# EAGLE design CS_SNS (EAGLE 9.5.0)
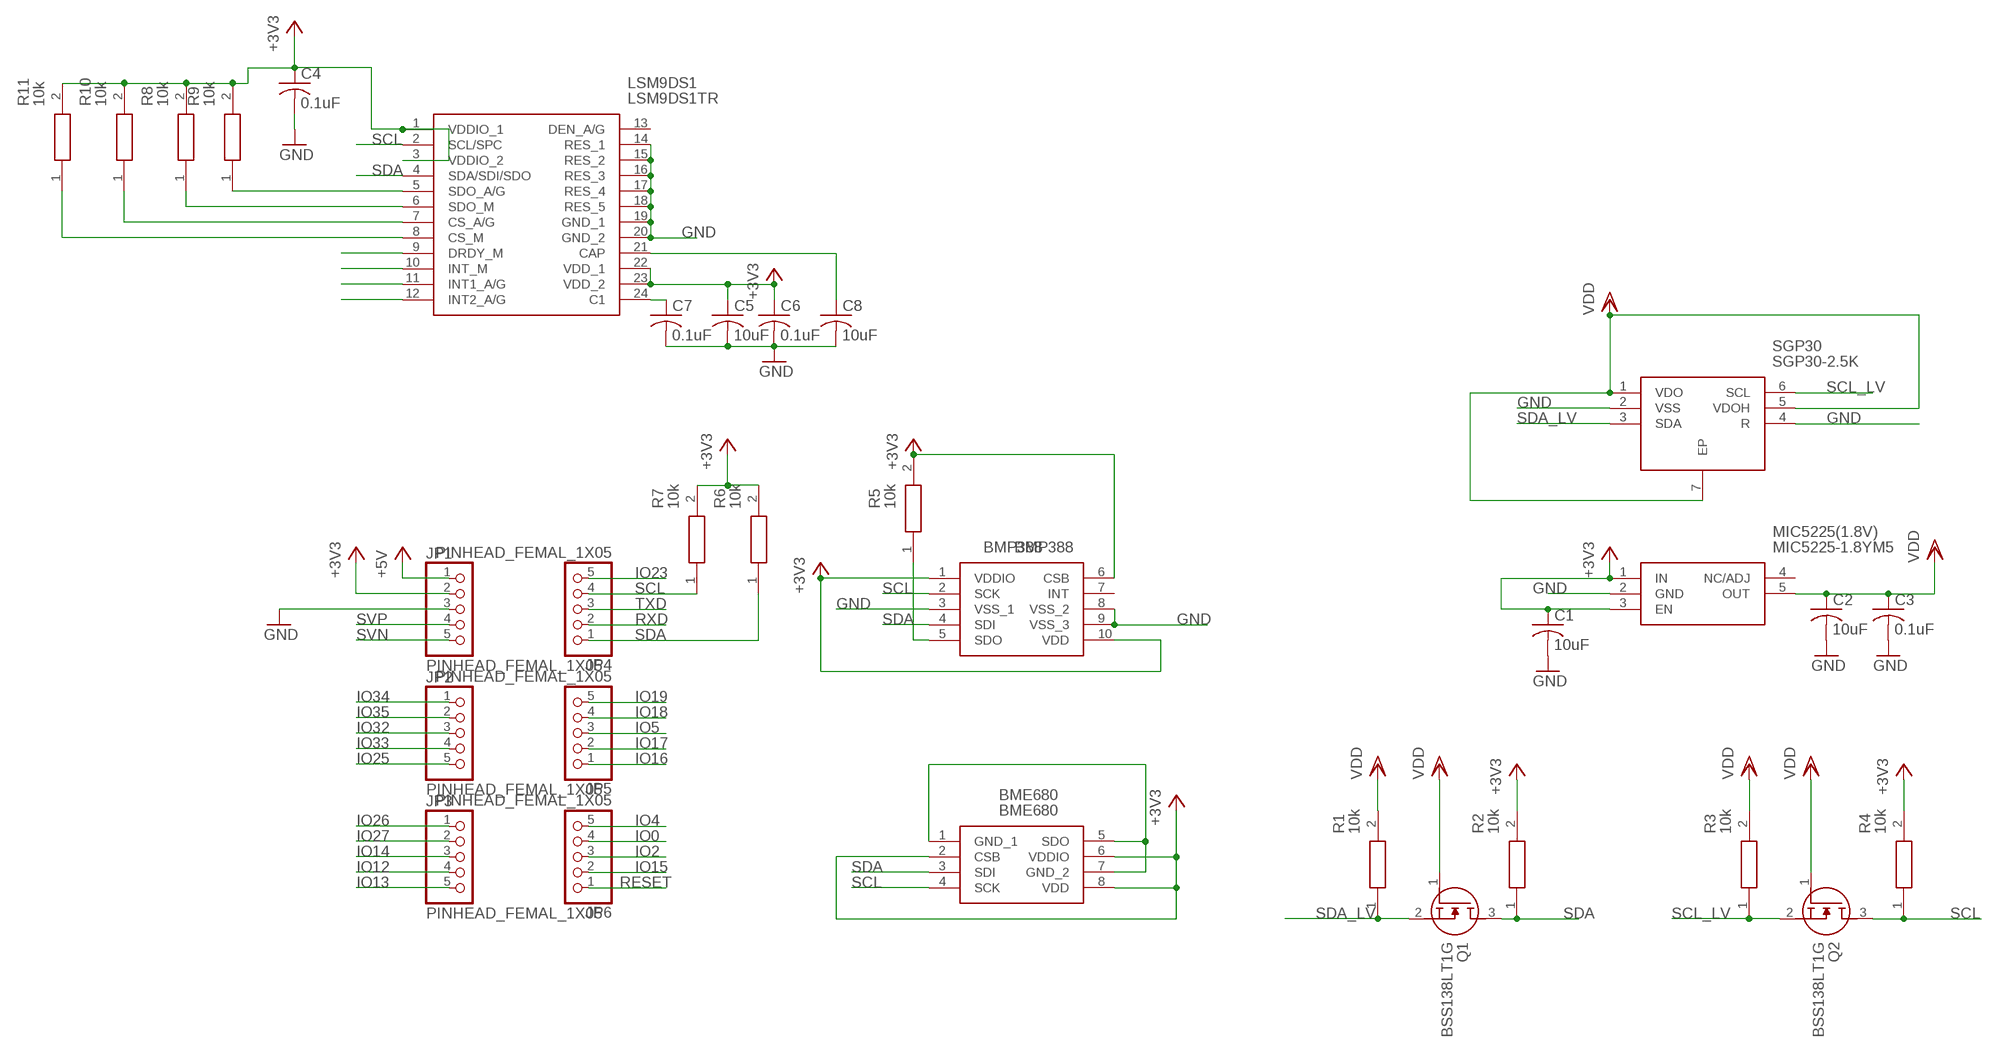
[diagram p0: schematic, sheet 1]

## Parts
BME680  BME680  [BME680]
BMP388  BMP388  [BMP388]
C1  10uF  C-USC0805  [C0805]
C2  10uF  C-USC0805  [C0805]
C3  0.1uF  C-USC0805  [C0805]
C4  0.1uF  C-USC0805  [C0805]
C5  10uF  C-USC0805  [C0805]
C6  0.1uF  C-USC0805  [C0805]
C7  0.1uF  C-USC0805  [C0805]
C8  10uF  C-USC0805  [C0805]
JP1  PINHEAD_FEMAL_1X05  [1X05F]
JP2  PINHEAD_FEMAL_1X05  [1X05F]
JP3  PINHEAD_FEMAL_1X05  [1X05F]
JP4  PINHEAD_FEMAL_1X05  [1X05F]
JP5  PINHEAD_FEMAL_1X05  [1X05F]
JP6  PINHEAD_FEMAL_1X05  [1X05F]
LSM9DS1  LSM9DS1TR  [LGA-24L(3X3.5X1MM)]
MIC5225(1.8V)  MIC5225-1.8YM5  [SOT95P280X145-5N]
Q1  BSS138LT1G  [SOT96P237X111-3N]
Q2  BSS138LT1G  [SOT96P237X111-3N]
R1  10k  ERA-6AED134V  [RESC2012X60N]
R2  10k  ERA-6AED134V  [RESC2012X60N]
R3  10k  ERA-6AED134V  [RESC2012X60N]
R4  10k  ERA-6AED134V  [RESC2012X60N]
R5  10k  ERA-6AED134V  [RESC2012X60N]
R6  10k  ERA-6AED134V  [RESC2012X60N]
R7  10k  ERA-6AED134V  [RESC2012X60N]
R8  10k  ERA-6AED134V  [RESC2012X60N]
R9  10k  ERA-6AED134V  [RESC2012X60N]
R10  10k  ERA-6AED134V  [RESC2012X60N]
R11  10k  ERA-6AED134V  [RESC2012X60N]
SGP30  SGP30-2.5K  [SON80P245X245X90-7N]

## Nets
+3V3: BME680.2(CSB) BME680.6(VDDIO) BME680.8(VDD) BMP388.1(VDDIO) BMP388.6(CSB) BMP388.10(VDD) C1.1 C4.1 C5.1 C6.1 JP1.2 LSM9DS1.1(VDDIO_1) LSM9DS1.3(VDDIO_2) LSM9DS1.22(VDD_1) LSM9DS1.23(VDD_2) MIC5225(1.8V).1(IN) MIC5225(1.8V).3(EN) R2.2 R4.2 R5.2 R6.2 R7.2 R8.2 R9.2 R10.2 R11.2
+5V: JP1.1
GND: BMP388.3(VSS_1) BMP388.8(VSS_2) BMP388.9(VSS_3) C1.2 C2.2 C3.2 C4.2 C5.2 C6.2 C7.2 C8.2 JP1.3 LSM9DS1.14(RES_1) LSM9DS1.15(RES_2) LSM9DS1.16(RES_3) LSM9DS1.17(RES_4) LSM9DS1.18(RES_5) LSM9DS1.19(GND_1) LSM9DS1.20(GND_2) MIC5225(1.8V).2(GND) SGP30.2(VSS) SGP30.4(R)
IO0: JP6.4
IO2: JP6.3
IO4: JP6.5
IO5: JP5.3
IO12: JP3.4
IO13: JP3.5
IO14: JP3.3
IO15: JP6.2
IO16: JP5.1
IO17: JP5.2
IO18: JP5.4
IO19: JP5.5
IO23: JP4.5
IO25: JP2.5
IO26: JP3.1
IO27: JP3.2
IO32: JP2.3
IO33: JP2.4
IO34: JP2.1
IO35: JP2.2
N$1: LSM9DS1.9(DRDY_M)
N$2: BMP388.5(SDO) R5.1
N$3: BME680.1(GND_1) BME680.5(SDO) BME680.7(GND_2)
N$4: LSM9DS1.5(SDO_A/G) R9.1
N$5: LSM9DS1.6(SDO_M) R8.1
N$6: C7.1 LSM9DS1.24(C1)
N$7: C8.1 LSM9DS1.21(CAP)
N$8: LSM9DS1.7(CS_A/G) R10.1
N$9: LSM9DS1.8(CS_M) R11.1
N$10: LSM9DS1.10(INT_M)
N$11: LSM9DS1.11(INT1_A/G)
N$12: LSM9DS1.12(INT2_A/G)
RESET: JP6.1
RXD: JP4.2
SCL: BME680.4(SCK) BMP388.2(SCK) JP4.4 LSM9DS1.2(SCL/SPC) Q2.3(D) R4.1 R7.1
SCL_LV: Q2.2(S) R3.1 SGP30.6(SCL)
SDA: BME680.3(SDI) BMP388.4(SDI) JP4.1 LSM9DS1.4(SDA/SDI/SDO) Q1.3(D) R2.1 R6.1
SDA_LV: Q1.2(S) R1.1 SGP30.3(SDA)
SVN: JP1.5
SVP: JP1.4
TXD: JP4.3
VDD: C2.1 C3.1 MIC5225(1.8V).5(OUT) Q1.1(G) Q2.1(G) R1.2 R3.2 SGP30.1(VDO) SGP30.5(VDOH) SGP30.7(EP)
Unconnected: BMP388.7(INT) LSM9DS1.13(DEN_A/G) MIC5225(1.8V).4(NC/ADJ)

## Library data of the parts
BME680 = SamacSys_3D:BME680: Air Quality Sensors Environmental Sensor VOC IIR EMC Source: Datasheet <https://ae-bst.resource.bosch.com/media/_tech/media/datasheets/BST-BME680-DS001.pdf>; DESCRIPTION: Air Quality Sensors Environmental Sensor VOC IIR EMC; HEIGHT: 1mm; MANUFACTURER_NAME: Bosch; MANUFACTURER_PART_NUMBER: BME680; MOUSER_PART_NUMBER: 262-BME680
BMP388 = SamacSys_3D:BMP388: Board Mount Pressure Sensors MEMS Absolute Barometric Pressure Sensor Source: Datasheet <https://ae-bst.resource.bosch.com/media/_tech/media/datasheets/BST-BMP388-DS001-01.pdf>; DESCRIPTION: Board Mount Pressure Sensors MEMS Absolute Barometric Pressure Sensor; HEIGHT: 0mm; MANUFACTURER_NAME: Bosch Sensortec; MANUFACTURER_PART_NUMBER: BMP388; MOUSER_PART_NUMBER: 262-BMP388; MOUSER_PRICE-STOCK: https://www.mouser.com/Search/Refine.aspx?Keyword=262-BMP388
C1-C8 = rcl:C-US: CAPACITOR, American symbol; SPICEPREFIX: C
JP1-JP6 = SamacSys_3D:PINHEAD_FEMAL_1X05
LSM9DS1 = SamacSys_3D:LSM9DS1TR: iNEMO Inertial 3D Accel/Gyro/Magn. LGA24 STMicroelectronics LSM9DS1TR 3-Axis Accelerometer, Gyroscope & Magnetometer, 0 400 kHz, 1.9 3.6 V Source: Datasheet <http://www.st.com/content/ccc/resource/technical/document/datasheet/1e/3f/2a/d6/25/eb/48/46/DM00103319.pdf/files/DM00103319.pdf/jcr:content/translations/en.DM00103319.pdf>; DESCRIPTION: iNEMO Inertial 3D Accel/Gyro/Magn. LGA24 STMicroelectronics LSM9DS1TR 3-Axis Accelerometer, Gyroscope & Magnetometer, 0 400 kHz, 1.9 3.6 V; HEIGHT: mm; MANUFACTURER_NAME: STMicroelectronics; MANUFACTURER_PART_NUMBER: LSM9DS1TR; MOUSER_PART_NUMBER: 511-LSM9DS1TR; MOUSER_PRICE-STOCK: https://www.mouser.com/Search/Refine.aspx?Keyword=511-LSM9DS1TR; RS_PART_NUMBER: 1660908; RS_PRICE-STOCK: https://uk.rs-online.com/web/p/products/1660908
MIC5225(1.8V) = SamacSys_3D:MIC5225-1.8YM5: Ultra-Low Quiescent Current 150mA uCap Low Dropout Regulator Source: Datasheet <http://www.mouser.com/ds/2/268/mic5225-1082288.pdf>; DESCRIPTION: Ultra-Low Quiescent Current 150mA uCap Low Dropout Regulator; HEIGHT: 1.45mm; MANUFACTURER_NAME: Micrel; MANUFACTURER_PART_NUMBER: MIC5225-1.8YM5
Q1 Q2 = SamacSys_3D:BSS138LT1G: MOSFET N-Channel 50V 0.2A SOT23 ON Semiconductor BSS138LT1G N-channel MOSFET Transistor, 0.2 A, 50 V, 3-Pin SOT-23 Source: Datasheet <http://www.onsemi.com/pub/Collateral/BSS138LT1-D.PDF>; ALLIED_NUMBER: 70099493; ALLIED_PRICE-STOCK: http://www.alliedelec.com/on-semiconductor-bss138lt1g/70099493/; DESCRIPTION: MOSFET N-Channel 50V 0.2A SOT23 ON Semiconductor BSS138LT1G N-channel MOSFET Transistor, 0.2 A, 50 V, 3-Pin SOT-23; HEIGHT: 1.11mm; MANUFACTURER_NAME: ON Semiconductor; MANUFACTURER_PART_NUMBER: BSS138LT1G; MOUSER_PART_NUMBER: 863-BSS138LT1G; MOUSER_PRICE-STOCK: https://www.mouser.com/Search/Refine.aspx?Keyword=863-BSS138LT1G; RS_PART_NUMBER: 5452529P; RS_PRICE-STOCK: http://uk.rs-online.com/web/p/products/5452529P
R1-R11 = SamacSys_3D:ERA-6AED134V: PANASONIC ELECTRONIC COMPONENTS - ERA-6AED134V - RES, THIN FILM, 130K, 0.5%, 0.125W, 0805 Source: Datasheet <https://industrial.panasonic.com/cdbs/www-data/pdf/RDA0000/AOA0000C237.pdf>; DESCRIPTION: PANASONIC ELECTRONIC COMPONENTS - ERA-6AED134V - RES, THIN FILM, 130K, 0.5%, 0.125W, 0805; HEIGHT: 0.6mm; MANUFACTURER_NAME: Panasonic; MANUFACTURER_PART_NUMBER: ERA-6AED134V; MOUSER_PART_NUMBER: 667-ERA-6AED134V; MOUSER_PRICE-STOCK: https://www.mouser.com/Search/Refine.aspx?Keyword=667-ERA-6AED134V
SGP30 = SamacSys_3D:SGP30-2.5K: Air Quality Sensors Multi-Pixel SGP Gas Sensor Source: Datasheet <http://www.mouser.com/ds/2/682/Sensirion_Gas_Sensors_SGP30_Preliminary_Datasheet-1128067.pdf>; DESCRIPTION: Air Quality Sensors Multi-Pixel SGP Gas Sensor; HEIGHT: 0.9mm; MANUFACTURER_NAME: Sensirion; MANUFACTURER_PART_NUMBER: SGP30-2.5k; MOUSER_PART_NUMBER: 403-SGP30-2.5K; MOUSER_PRICE-STOCK: https://www.mouser.com/Search/Refine.aspx?Keyword=403-SGP30-2.5K; RS_PART_NUMBER: 1463573; RS_PRICE-STOCK: http://uk.rs-online.com/web/p/products/1463573

## Board
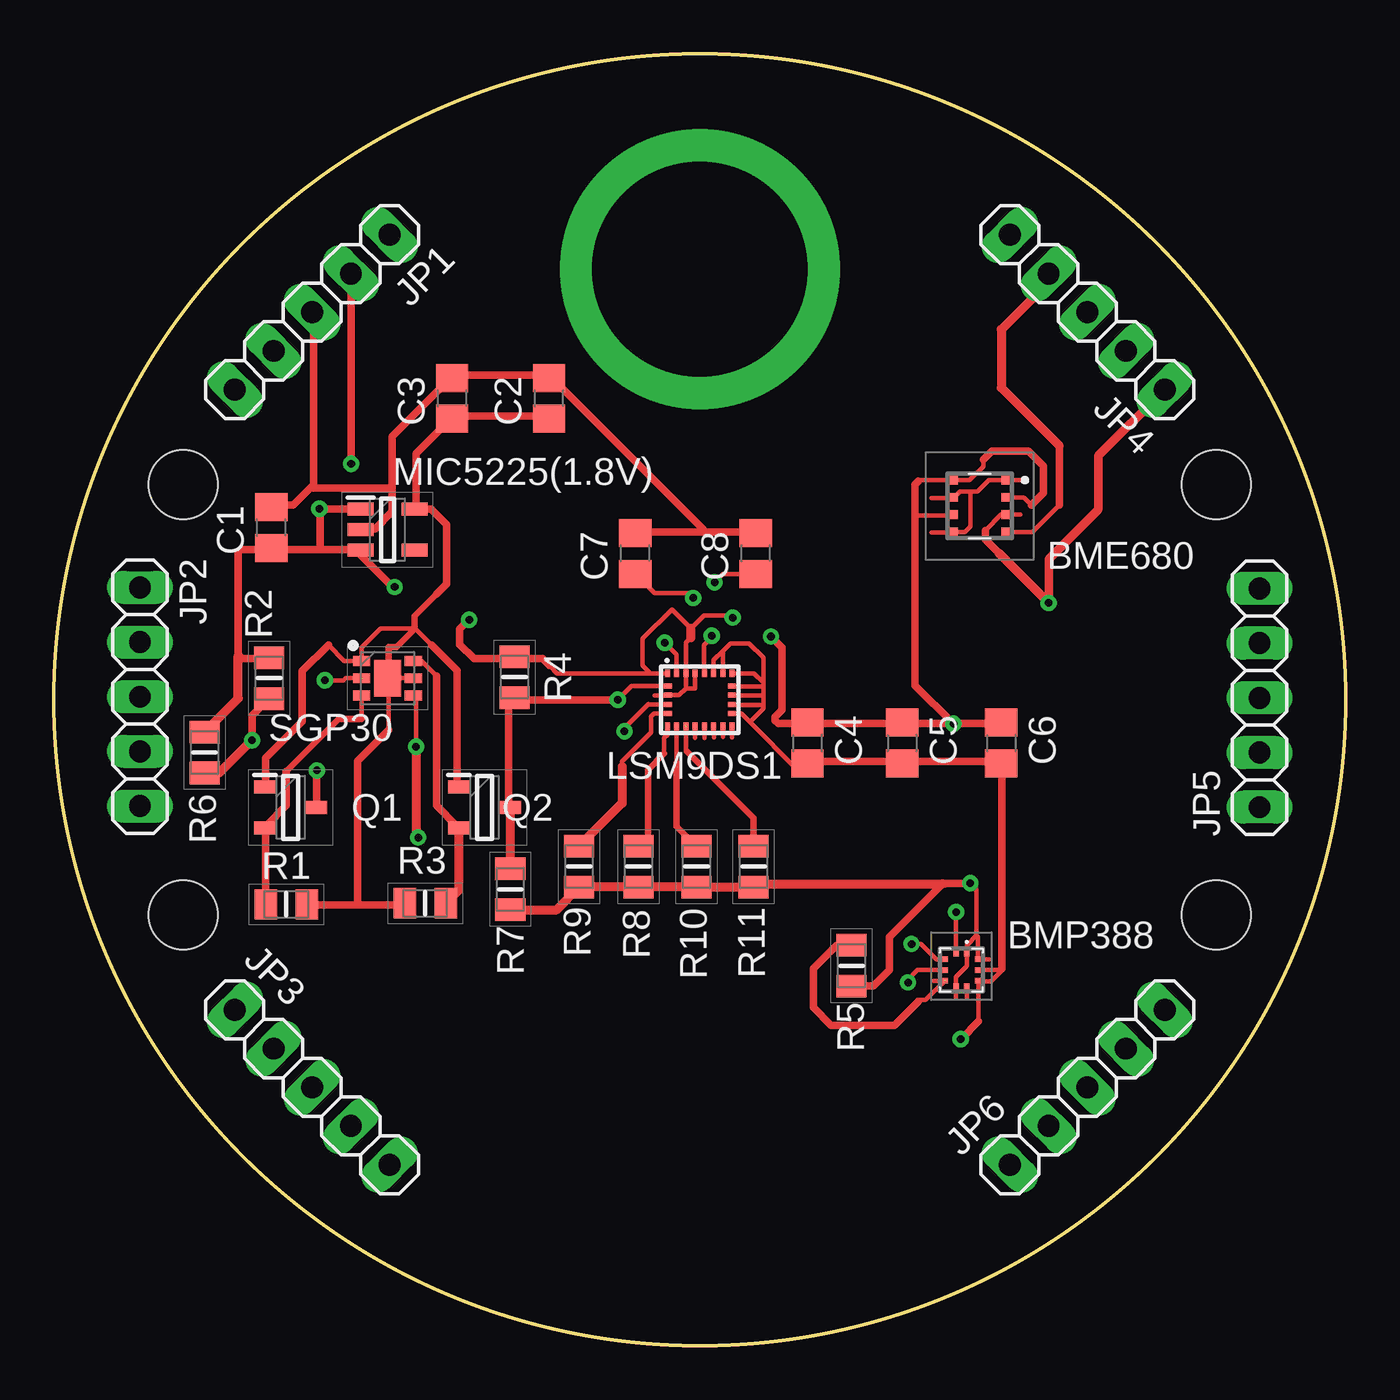
[diagram p1: board, top side]
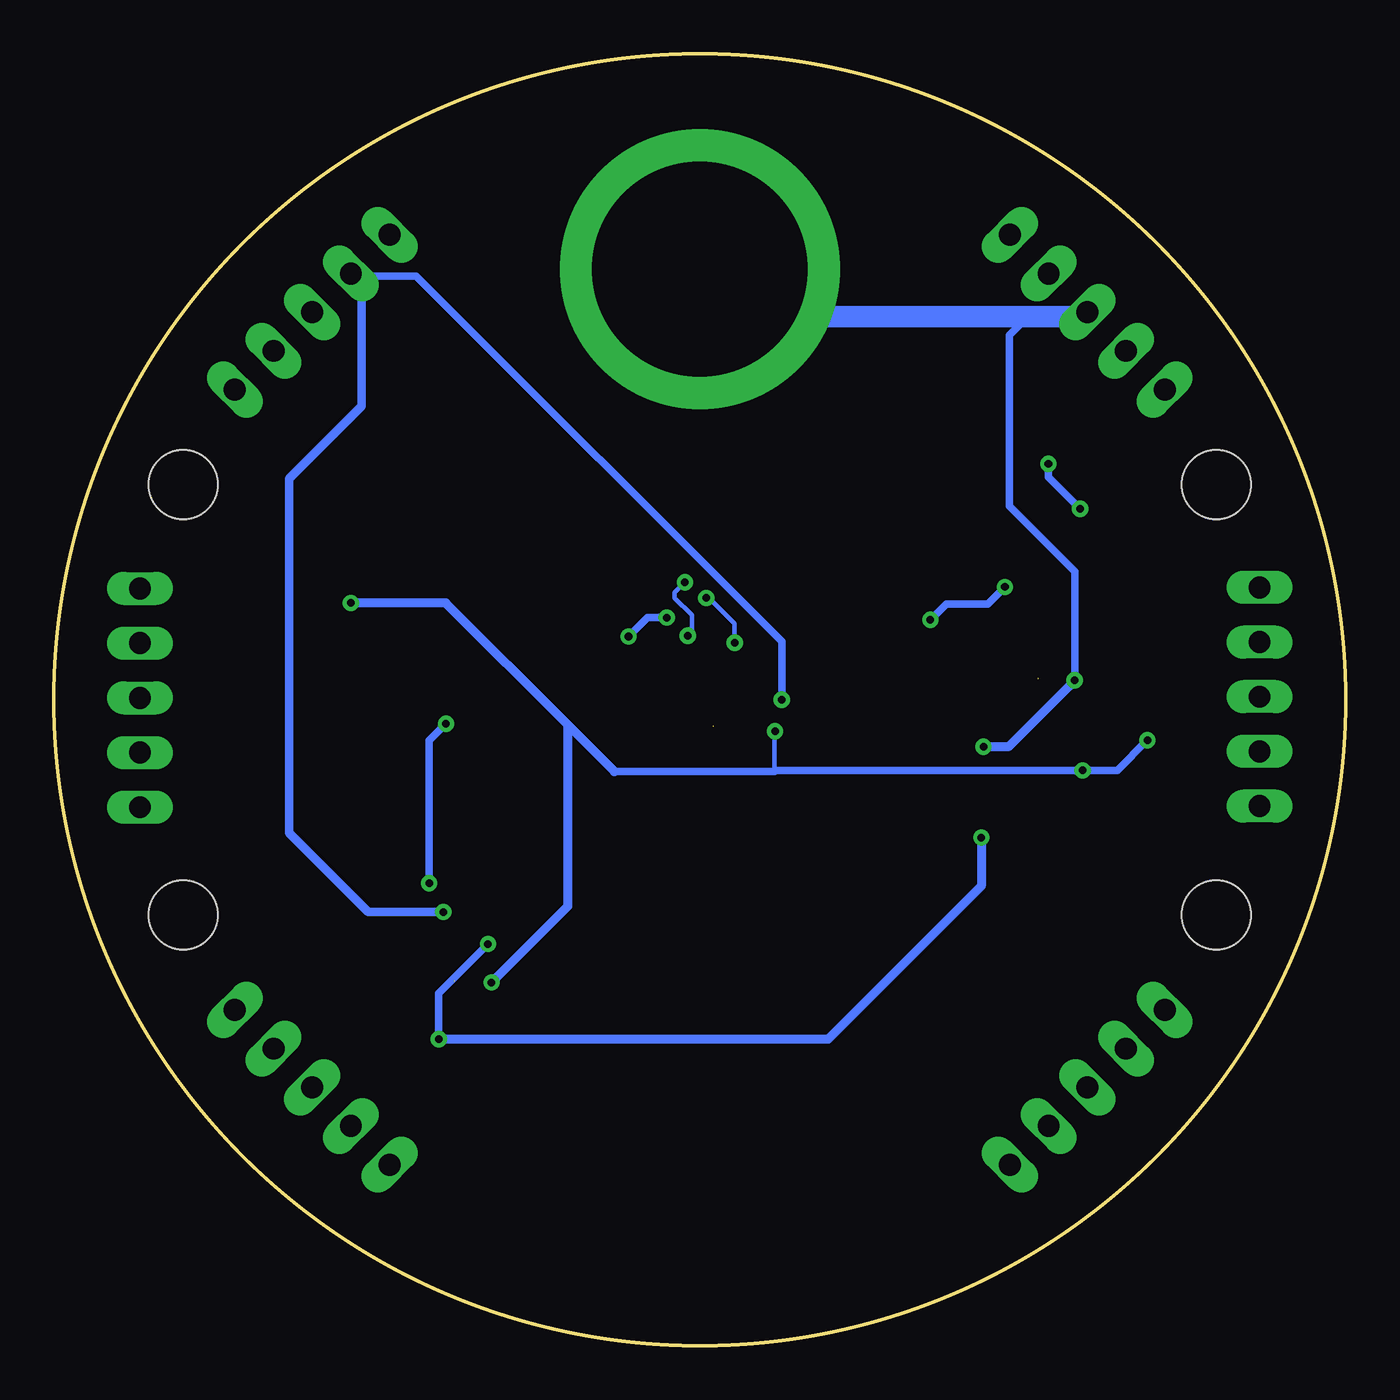
[diagram p2: board, bottom side, seen from below]

Size 60 x 60 mm. Coordinates in mm from the lower left corner, seen from the top.
Outline: circle at 30,30 radius 30
Copper layers (1*16): Top 0.035mm / dielectric 1.5mm / Bottom 0.035mm
Design rules "CanSat *": minimum track width 0.2mm, minimum drill 0.35mm, track to track 8mil, track to pad 8mil, pad to pad 7mil, via to via 15mil, smd to smd 6mil, copper to edge 1.5mm, drill to drill 10mil, minimum pad ring 10mil, minimum via ring 8mil, stop-mask expansion 6mil, vias tented up to drill 0mil, thermal gap 8mil
Holes 3.2 mm at 6,40 6,20 54,40 54,20

### Footprints (pad centres in the part's own frame; a part is rotated, then mirrored left to right if it is on the bottom)
BME680 = smd 0.4 x 0.4: 1 1.2,1.2; 2 1.2,0.4; 3 1.2,-0.4; 4 1.2,-1.2; 5 -1.2,-1.2; 6 -1.2,-0.4; 7 -1.2,0.4; 8 -1.2,1.2
BMP388 = smd 0.25 x 0.275: 1 0.25,0.763; 2 -0.25,0.763; 6 -0.25,-0.763; 7 0.25,-0.763 | smd 0.275 x 0.25: 3 -0.762,0.5; 4 -0.762,0; 5 -0.762,-0.5; 8 0.762,-0.5; 9 0.762,0; 10 0.762,0.5
C0805 = smd 1.3 x 1.5: 1 -0.95,0; 2 0.95,0
1X05F = drill 1.016 long: 1 -5.08,0; 2 -2.54,0; 3 0,0; 4 2.54,0; 5 5.08,0
LGA-24L(3X3.5X1MM) = smd 0.23 x 0.35: 1 -1.505,1.225; 6 -1.505,-1.225; 7 -1.075,-1.225; 8 -0.645,-1.225; 9 -0.215,-1.225; 10 0.215,-1.225; 11 0.645,-1.225; 12 1.075,-1.225; 13 1.505,-1.225; 18 1.505,1.225; 19 1.075,1.225; 20 0.645,1.225; 21 0.215,1.225; 22 -0.215,1.225; 23 -0.645,1.225; 24 -1.075,1.225 | smd 0.35 x 0.23: 2 -1.475,0.645; 3 -1.475,0.215; 4 -1.475,-0.215; 5 -1.475,-0.645; 14 1.475,-0.645; 15 1.475,-0.215; 16 1.475,0.215; 17 1.475,0.645
SOT95P280X145-5N = smd 1.2 x 0.6: 1 -1.25,0.95; 2 -1.25,0; 3 -1.25,-0.95; 4 1.25,-0.95; 5 1.25,0.95
SOT96P237X111-3N = smd 1 x 0.6: 1 -1.2,0.955; 2 -1.2,-0.955; 3 1.2,0
RESC2012X60N = smd 1.05 x 1.4: 1 -0.95,0; 2 0.95,0
SON80P245X245X90-7N = smd 0.8 x 0.45: 1 -1.2,0.8; 2 -1.2,0; 3 -1.2,-0.8; 4 1.2,-0.8; 5 1.2,0; 6 1.2,0.8 | smd 1.25 x 1.7: 7 0,0

### Placement (x,y rotation side)
BME680  43,39 0 top
BMP388  42.15,17.45 0 top
C1  10.1,38 90 top
C2  23,44 90 top
C3  18.5,44 90 top
C4  35,28 270 top
C5  39.4,28 270 top
C6  44,28 270 top
C7  27,36.8 90 top
C8  32.6,36.8 90 top
JP1  12,48 225 top
JP2  4,30.14 270 top
JP3  12,12 315 top
JP4  48,48 135 top
JP5  56,30.09 90 top
JP6  48,12 45 top
LSM9DS1  30,30 0 top
MIC5225(1.8V)  15.5,37.9 0 top
Q1  11,25 0 top
Q2  20,25 0 top
R1  10.8,20.5 0 top
R2  10,31 90 top
R3  17.25,20.55 180 top
R4  21.4,31.05 90 top
R5  37.05,17.65 270 top
R6  7,27.55 90 top
R7  21.2,21.2 270 top
R8  27.15,22.25 270 top
R9  24.4,22.25 270 top
R10  29.85,22.25 270 top
R11  32.5,22.25 270 top
SGP30  15.5,31 0 top

### Tracks (layer width: path | path; a pad name or v marks a point on that pad's centre or on a via)
+3V3  (via drill 0.35)
  Top 0.203: 42.85,19.05 42.4,18.6 BMP388.1 42.4,17.63 41.9,17.12 BMP388.6 41.9,16.15 | 42.85,19.05 42.91,18.99 BMP388.10 43.45,17.95 | v42.57,21.48 42.85,21.2 42.85,19.05 | 23.02,31.59 23.38,31.23 LSM9DS1.1 27.71,31.23 27.35,31.58 27.35,32.84 28.7,34.19 29.58,33.31 30.19,33.92 31.43,33.92 v31.53,33.82 | LSM9DS1.22 29.79,31.18 29.79,30.93 29.79,30.51 29.37,30.51 29.36,30.53 | 40.16,40.16 40.16,40.2 BME680.8 42.53,40.2 43.18,40.84 43.18,41.16 | BME680.2 45.05,39.4 45.41,39.03 | 40,38.55 41.75,38.55 BME680.6 | 29.36,30.53 LSM9DS1.23 29.36,32.65 29.58,32.88 | 29.36,30.53 29.04,30.21 LSM9DS1.3 28.22,30.2 27.9,30.2
  Top 0.35: 12.38,36.98 10.16,36.98 C1.1 10,36.98 8.73,36.98 8.57,36.83 8.57,32.06 8.73,31.91 10,31.91 R2.2 | 12.38,36.98 14.12,36.98 MIC5225(1.8V).3 14.25,36.71 15.72,35.24 v15.83,35.24 | 12.38,36.98 12.38,38.81 v12.33,38.87 14.2,38.87 MIC5225(1.8V).1 | v13.81,40.95 13.81,49.69 JP1.2 | 23.02,31.59 22.7,31.91 21.63,31.91 R4.2 21.3,31.91 19.52,31.91 18.86,32.57 18.86,33.28 v19.29,33.71 | R5.2 37.07,16.7 38.06,16.7 38.82,17.46 38.82,19 41.28,21.45 41.4,21.45 41.43,21.48 v42.57,21.48 | 40.16,40.16 40,40 40,38.55 40,30.67 v41.79,28.89 | 45.41,39.03 45.97,39.59 45.97,40.84 45.27,41.54 43.56,41.54 43.18,41.16 | v41.79,28.89 39.52,28.89 C5.1 39.37,28.89 35.08,28.89 C4.1 34.92,28.89 33.65,28.89 33.49,29.05 33.49,29.21 33.81,29.52 33.81,32.43 v33.31,32.94 | v41.79,28.89 43.97,28.89 C6.1
  Top 0.406: R7.2 23.35,20.25 R9.2 R8.2 R10.2 R11.2 32.66,21.45 41.28,21.45 | R6.2 8.57,30.07 8.57,32.06 | 29.58,32.88 29.58,33.31
  Bottom 0.35: v13.81,40.95 13.81,40.34 v12.33,38.87 | v41.79,28.89 42.57,28.11 v42.57,21.48 | v33.31,32.94 32.43,33.82 v31.53,33.82 | v19.29,33.71 18.55,34.45 16.61,34.45 v15.83,35.24
GND  (via drill 0.35, 10 pad 13)  (1 unrouted)
  Top 0.203: BMP388.3 40.99,17.95 40.28,18.66 v39.84,18.66 | 42.95,15.06 42.95,16.92 | 42.95,16.92 BMP388.8 | BMP388.9 43.98,17.45 44.04,17.5 44.04,17.44 43.52,16.92 42.95,16.92 | LSM9DS1.18 32.52,31.23 32.95,30.79 | 32.95,30.79 32.95,30.58 | 32.95,30.58 32.95,30.2 | 32.95,30.2 32.95,29.75 | 32.95,29.75 32.95,29.59 32.33,28.96 | LSM9DS1.14 31.93,29.36 32.33,28.96 | LSM9DS1.17 31.5,30.62 32.91,30.62 32.95,30.58 | LSM9DS1.16 31.5,30.19 32.94,30.19 32.95,30.2 | LSM9DS1.15 31.5,29.76 32.94,29.76 32.95,29.75 | LSM9DS1.20 30.64,31.84 31.07,32.27 | 32.95,30.79 32.95,31.95 32.29,32.61 31.42,32.61 31.07,32.27 | LSM9DS1.19 31.07,32.27 | 32.33,28.96 34.52,26.77 34.52,26.58 | v12.59,30.9 13.45,30.9 13.55,31 SGP30.2 | SGP30.4 16.82,30.08 v16.82,27.82 | 14.3,30.97 14.28,30.95
  Top 0.35: 15.71,39.84 15.71,42.22 18.41,44.92 C3.2 18.57,45.08 22.86,45.08 C2.2 23.17,44.92 30.16,37.94 30.16,37.78 | 15.71,39.84 15.71,38.73 14.92,37.94 14.28,37.94 MIC5225(1.8V).2 | 12.06,39.99 11.12,39.05 10.16,39.05 C1.2 | 15.71,39.84 12.06,39.84 12.06,39.99 | 12.06,39.99 12.06,47.94 JP1.3 | 30.16,37.78 32.54,37.78 C8.2 | 30.16,37.78 27.14,37.78 C7.2 | v42.12,14.23 42.95,15.06 | 34.52,26.58 34.92,26.98 C4.2 35.08,27.14 39.37,27.14 C5.2 39.52,27.14 43.97,27.14 | 43.97,27.14 44.04,27.14 44.04,17.5 | 43.97,27.14 C6.2
  Top 0.406: v16.92,23.6 16.82,23.7 v16.82,27.82
  Bottom 0.35: v12.59,30.9 12.59,35.95 15.62,38.98 15.62,46.93 14.76,47.79 | v42.12,14.23 42.12,16.37 v39.84,18.66
  Bottom 0.406: v16.92,23.6 16.92,21.35 24.04,14.23 v42.12,14.23 | v12.59,30.9 15.67,27.82 v16.82,27.82
  Bottom 1: JP1.3 12.2,47.8 13.72,47.8 13.73,47.79 14.44,47.79 14.76,47.79 27.79,47.79 v30,50
N$1
  Top 0.203: LSM9DS1.9 29.78,28.22
N$2  (1 unrouted)
  Top 0.203: BMP388.5 40.49,16.05 40.1,16.05 40.15,16 | BMP388.5 40.85,16.95
  Top 0.35: 40.15,16 39.04,14.89 36.09,14.89 35.27,15.71 35.27,17.52 36.35,18.6 R5.1
N$3
  Top 0.203: 42.57,39.68 42.08,39.68 BME680.7 41.77,39.37 40.77,39.37 | 42.57,39.68 42.9,39.68 43.42,40.2 BME680.1 44.9,40.2 | 42.57,39.68 42.57,38.05 42.32,37.8 BME680.5 41.77,37.77 40.77,37.77
N$4
  Top 0.203: LSM9DS1.5 27.88,29.36 27.74,29.21 27.74,28.48 26.4,27.14 26.4,26.9
  Top 0.406: 26.4,26.9 26.4,25.2 R9.1
N$5
  Top 0.203: LSM9DS1.6 28.5,28.38 28.34,28.23 28.34,27.5
  Top 0.3: 28.34,27.5 27.6,26.75 27.6,23.65 R8.1
N$6  (via drill 0.35)
  Top 0.203: LSM9DS1.24 28.91,31.23 28.91,32.11 v28.38,32.65 | v29.69,34.73 29.47,34.95 27.9,34.95 C7.1
  Bottom 0.203: v28.38,32.65 28.38,33.54 29.57,34.73 v29.69,34.73
N$7  (via drill 0.35)
  Top 0.203: LSM9DS1.21 30.2,32.54 30.56,32.89 v30.56,32.97 | v30.69,35.46 31.07,35.85 C8.1
  Bottom 0.203: v30.56,32.97 30.37,33.16 30.37,33.92 31.17,34.72 31.17,34.98 v30.69,35.46
N$8
  Top 0.203: LSM9DS1.7 28.93,27.07
  Top 0.3: 28.93,27.07 28.93,24.12 R10.1
N$9  (1 unrouted)
  Top 0.203: 29.36,28.77 29.36,27.63 29.41,27.59
  Top 0.3: 29.41,27.59 32.5,24.5 R11.1
N$10
  Top 0.203: LSM9DS1.10 30.21,28.22
N$11
  Top 0.203: LSM9DS1.11 30.65,28.25
N$12
  Top 0.203: LSM9DS1.12 31.08,28.27
N$13
  Top 0.203: 42.4,16.65 42.4,16.15
N$14
  Top 0.203: 31.5,28.75 31.5,28.25
SCL  (via drill 0.35)
  Top 0.203: v26.19,30 26.84,30.64 LSM9DS1.2 | v41.9,20.14 BMP388.2 | BME680.4 45.45,37.8 46.69,39.04
  Top 0.35: Q2.3 21.11,25.08 21.11,29.97 R4.1 21.94,30 v26.19,30 | 46.69,41.8 46.69,39.04
  Top 0.406: JP4.4 46.2,49.4 44,47.2 44,44.49 46.69,41.8 | Q2.3 R7.1
  Bottom 0.35: v26.19,30 26.19,32.69 43.18,49.69 46.19,49.69 JP4.4
  Bottom 0.4: v41.9,20.14 45.41,20.14 49.08,23.81 49.08,40.26 45.7,43.64 45.7,49.29 JP4.4
SCL_LV
  Top 0.203: SGP30.6 17.09,31.8 17.78,31.11
  Top 0.35: 17.78,31.11 17.78,25.08 18.73,24.13 Q2.2
  Top 0.406: Q2.2 18.8,21.15 R3.1
SDA  (via drill 0.35)
  Top 0.203: BMP388.4 40.12,17.45 39.67,17 v39.67,16.87 | v26.5,28.53 26.5,28.68 27.62,29.79 LSM9DS1.4 | 43.27,37.87 44,38.6 BME680.3 44.9,38.6
  Top 0.35: v12.21,26.72 Q1.3 | R2.1 9.21,29.26 v9.21,28.12 | 43.27,37.87 43.27,37.44 43.87,36.83 | 43.87,36.83
  Top 0.4: JP4.1 48.52,41.33 48.52,38.84 46.2,36.53 v46.2,34.5 | v46.2,34.5 | v46.2,34.5 43.87,36.83
  Top 0.406: R6.1 7.69,26.6 v9.21,28.12
  Bottom 0.203: 26.52,26.67 26.52,26.72 26.52,28.51 v26.5,28.53
  Bottom 0.35: v9.21,28.12 10.61,26.72 v12.21,26.72 26.52,26.72 | 33.97,26.67 26.52,26.67
  Bottom 0.406: v39.67,16.87 36.12,20.42 36.12,28.82 | 36.12,28.82 41.8,34.5 v46.2,34.5 | 36.12,28.82 33.97,26.67
SDA_LV
  Top 0.203: 14.3,29.11 14.3,30.14 14.28,30.16
  Top 0.3: 10.79,26.67 13.24,29.11 14.3,29.11
  Top 0.35: 10.79,26.67 10.79,25.08 9.84,24.13 Q1.2 9.84,23.97 9.84,20.63 R1.1 | 14.28,30.16 SGP30.3
VDD
  Top 0.203: 12.75,32.54 13.49,31.8 SGP30.1 14.3,32.44 15.17,33.3 16.74,33.3 | 16.74,33.3 16.75,33.29 | 17.55,32.54 16.79,33.3 16.74,33.3 | SGP30.5 SGP30.7 15.55,30.95 15.55,28.6
  Top 0.305: 17.78,34.92 16.75,33.9 16.75,33.29 15.91,32.45 15.55,32.45 15.55,30.95
  Top 0.35: C2.1 22.86,43.18 18.57,43.18 C3.1 18.41,43.02 16.82,41.43 16.82,38.89 MIC5225(1.8V).5 17.53,38.85 18.23,38.15 18.23,35.38 17.78,34.92 | 14.1,20.48 16.29,20.48 R3.2 | 14.1,20.48 11.9,20.48 R1.2 | 16.66,30.95 SGP30.5 | 15.55,30.95 SGP30.7 | 12.75,32.54 11.54,31.32 11.54,29 9.84,27.3 9.84,26.03 Q1.1 | 17.55,32.54 18.73,31.36 18.73,26.03 Q2.1 | 15.55,28.6 14.1,27.15 14.1,20.48